# EAGLE design tweeq-Downloader_Basicv4 (EAGLE 7.2.0)
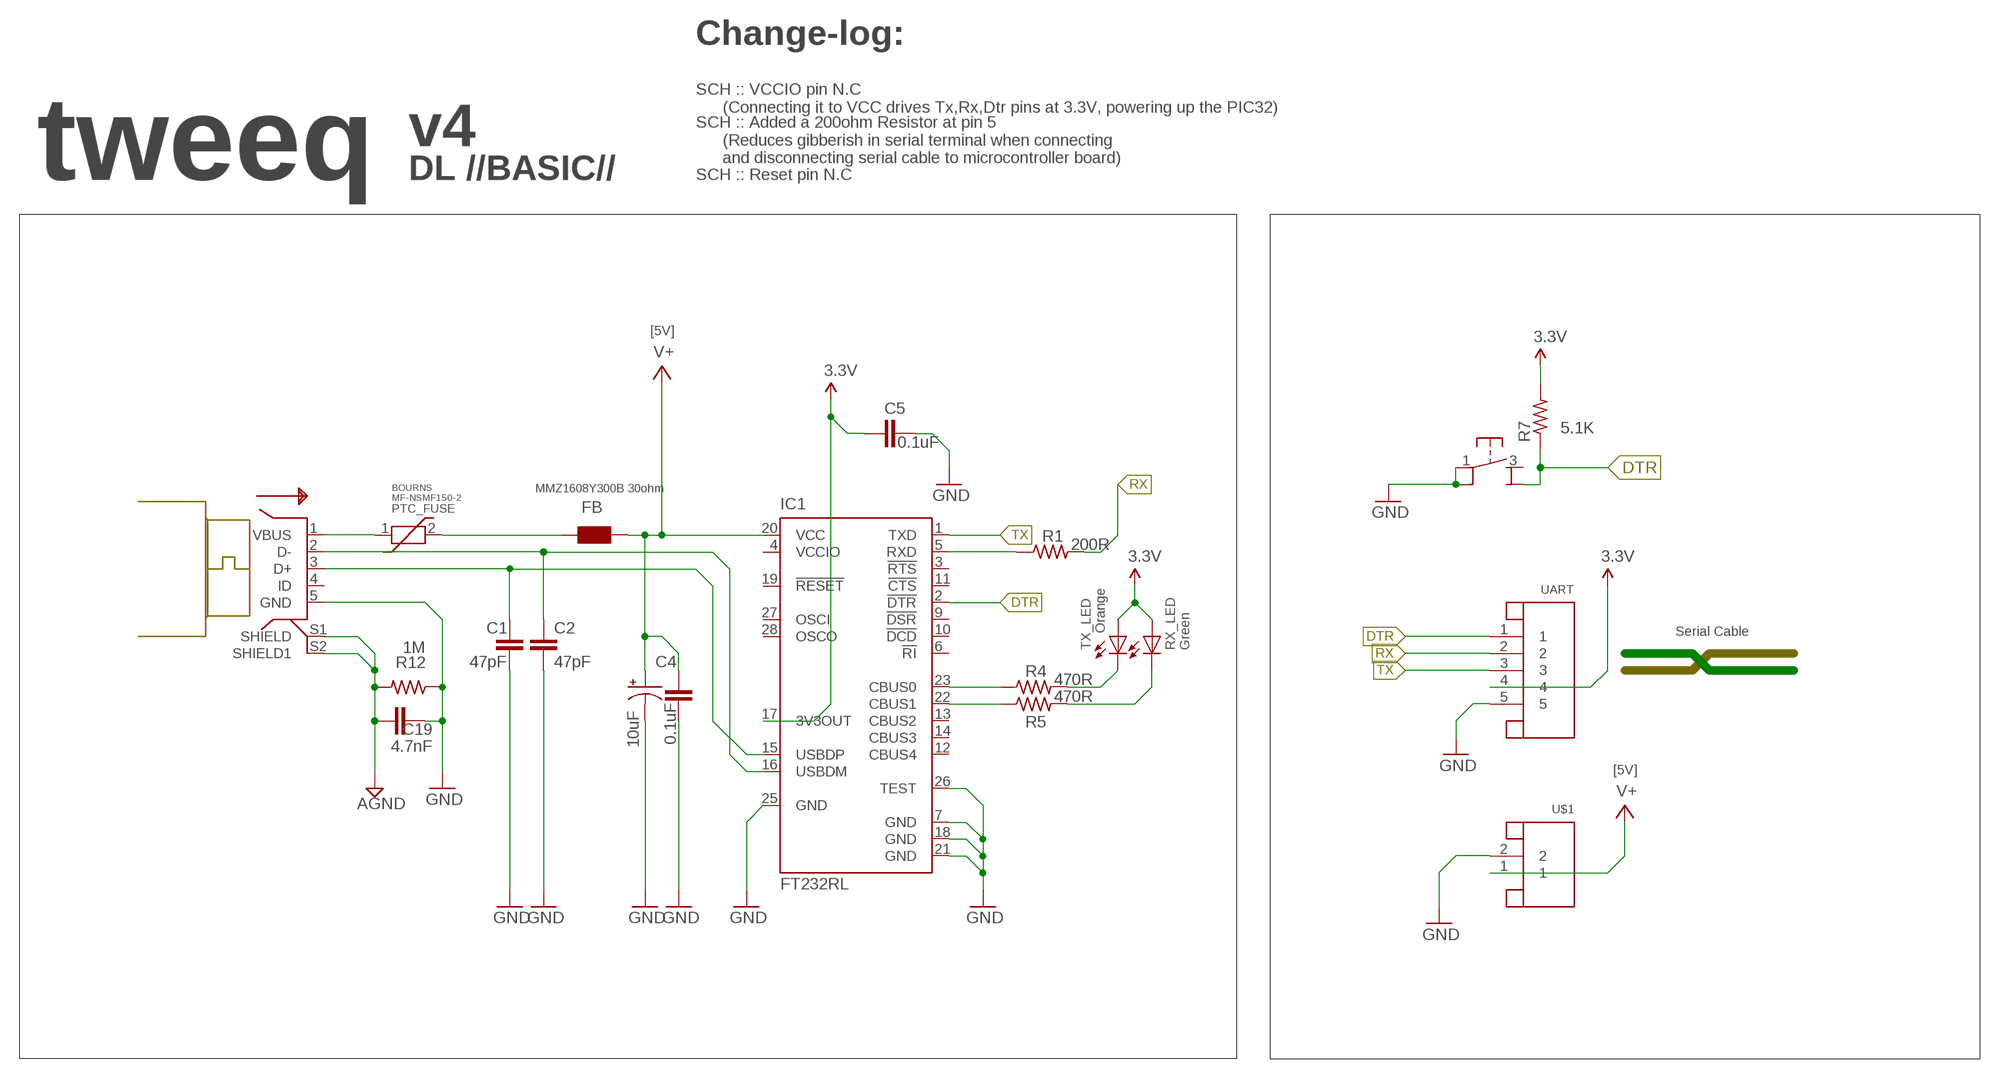
[diagram p0: schematic, sheet 1]

## Parts
C1  47pF  C-EUC0603K  [C0603K]
C2  47pF  C-EUC0603K  [C0603K]
C3  10uF  CPOL-USSMCA  [SMC_A]
C4  0.1uF  C-EUC0603K  [C0603K]
C5  0.1uF  C-EUC0603K  [C0603K]
C19  4.7nF  C-EUC0603K  [C0603K]
FB  MMZ1608Y300B 30ohm  WE-CBF_0603  [0603]
IC1  FT232RL  [SSOP28]
PTC_FUSE  PTC_FUSE/MF-NSMF150-2  [1206F]
R1  200R  R-US_R0603  [R0603]
R4  470R  R-US_R0603  [R0603]
R5  470R  R-US_R0603  [R0603]
R7  5.1K  R-US_R0603  [R0603]
R12  1M  R-US_R0603  [R0603]
RX_LED  Green  LEDCHIP-LED0805  [CHIP-LED0805]
TX_LED  Orange  LEDCHIP-LED0805  [CHIP-LED0805]
U$1  JST-2PINSH  [SH1.0-2PIN]
U$2  USB/MICRO-5PF-B  [MICRO_USB_5PF_B]
U$4  PB_MICRO_SMT  [PB_SMT_3.5X3X2]
UART  JST-5PINSH  [SH1.0-5PIN]

## Nets
3.3V: C5.1 IC1.17(3V3OUT) R7.2 RX_LED.A TX_LED.A UART.4
AGND: C19.2 R12.2 U$2.S1(SHIELD) U$2.S2(SHIELD1)
D+: C1.1 IC1.15(USBDP) U$2.3(D+)
D-: C2.1 IC1.16(USBDM) U$2.2(D-)
DTR: IC1.2(!DTR) R7.1 U$4.4(2A) UART.1
GND: C1.2 C2.2 C3.- C4.2 C5.2 C19.1 IC1.7(GND) IC1.18(GND) IC1.21(GND) IC1.25(GND) IC1.26(TEST) R12.1 U$1.2 U$2.5(GND) U$4.1 U$4.2(1A) UART.5
N$1: PTC_FUSE.1 U$2.1(VBUS)
N$2: FB.2 PTC_FUSE.2
N$3: IC1.5(RXD) R1.1
N$9: IC1.23(CBUS0) R4.1
N$10: IC1.22(CBUS1) R5.1
N$11: R4.2 TX_LED.C
N$12: R5.2 RX_LED.C
RX: R1.2 UART.2
TX: IC1.1(TXD) UART.3
V+: C3.+ C4.1 FB.1 IC1.20(VCC) U$1.1
Unconnected: IC1.3(!RTS) IC1.6(!RI) IC1.9(!DSR) IC1.10(!DCD) IC1.11(!CTS) IC1.12(CBUS4) IC1.13(CBUS2) IC1.14(CBUS3) IC1.19(!RESET) IC1.27(OSCI) IC1.28(OSCO) U$2.4(ID) U$4.3

## Notes on the sheet
- Change-log:
- SCH :: VCCIO pin N.C 
        (Connecting it to VCC drives Tx,Rx,Dtr pins at 3.3V, powering up the PIC32)
- v4
- SCH :: Added a 200ohm Resistor at pin 5 
        (Reduces gibberish in serial terminal when connecting
        and disconnecting serial cable to microcontroller board)
- tweeq | DL //BASIC// | SCH :: Reset pin N.C
- [5V]
- BOURNS
  MF-NSMF150-2
- Serial Cable
- [5V]

## Power pins joined to a net without a drawn wire
VCCIO: IC1.4(VCCIO)

## Library data of the parts
C1 C2 C4 C5 = AISCube:C-EU: CAPACITOR, European symbol
C3 = AISCube:CPOL-US: POLARIZED CAPACITOR, American symbol
C19 = rcl:C-EU: CAPACITOR, European symbol
FB = wuerth-elektronik:WE-CBF: SMD EMI Suppression Ferrite Beads - excellent anti-EMI properties - low DCR - impedances till 3000 ohms - rated current up to 6 A
IC1 = ftdichip:FT232R: Source: http://www.ftdichip.com/Documents/DataSheets/DS_FT232R_v104.pdf; MPN: FT232RL; OC_FARNELL: 1146032; OC_NEWARK: 91K9918
PTC_FUSE = AISCube:PTC_FUSE: MF-NSMF Series - PTC Resettable Fuses
R1 R4 R5 R7 R12 = AISCube:R-US_: RESISTOR, American symbol
RX_LED TX_LED = AISCube:LED: LED OSRAM: - CHIPLED LG R971, LG N971, LY N971, LG Q971, LY Q971, LO R971, LY R971 LH N974, LH R974 LS Q976, LO Q976, LY Q976 LO Q996 - Hyper CHIPLED LW Q18S LB Q993, LB Q99A, LB R99A - SideLED LS A670, LO A670, LY A670, LG A670, LP A670 LB A673, LV A673, LT A673, LW A673 LH A674 LY A675 LS A676, LA A676, LO A676, LY A676, LW A676 LS A679, LY A679, LG A679 - Hyper Micro SIDELED® LS Y876, LA Y876, LO Y876, LY Y876 LT Y87S - SmartLED LW L88C, LW L88S LB L89C, LB L89S, LG L890 LS L89K, LO L89K, LY L89K LS L896, LA L896, LO L896, LY L896 - TOPLED LS T670, LO T670, LY T670, LG T670, LP T670 LSG T670, LSP T670, LSY T670, LOP T670, LYG T670 LG T671, LOG T671, LSG T671 LB T673, LV T673, LT T673, LW T673 LH T674 LS T676, LA T676, LO T676, LY T676, LB T676, LH T676, LSB T676, LW T676 LB T67C, LV T67C, LT T67C, LS T67K, LO T67K, LY T67K, LW E67C LS E67B, LA E67B, LO E67B, LY E67B, LB E67C, LV E67C, LT E67C LW T67C LS T679, LY T679, LG T679 LS T770, LO T770, LY T770, LG T770, LP T770 LB T773, LV T773, LT T773, LW T773 LH T774 LS E675, LA E675, LY E675, LS T675 LS T776, LA T776, LO T776, LY T776, LB T776 LHGB T686 LT T68C, LB T68C - Hyper Mini TOPLED® LB M676 - Mini TOPLED Santana® LG M470 LS M47K, LO M47K, LY M47K Source: http://www.osram.convergy.de/
U$1 = AISCube:JST-2PIN
U$2 = AISCube:USB: USB 1.x/2.0 Mini/Micro Pinout Pin Name Cable color Description 1 VBUS Red +5 V 2 D− White Data − 3 D+ Green Data + 4 ID N/A Permits distinction of a host connection from device connection: • host: connected to the signal ground • device: not connected 5 GND Black Signal ground
U$4 = AISCube:PB_MICRO_SMT
UART = AISCube:JST-5PIN: JST 5 Pin

## Board
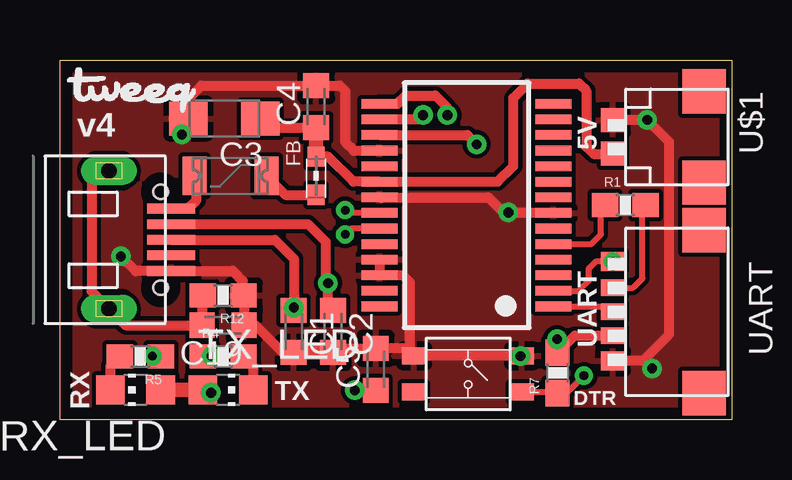
[diagram p1: board, top side]
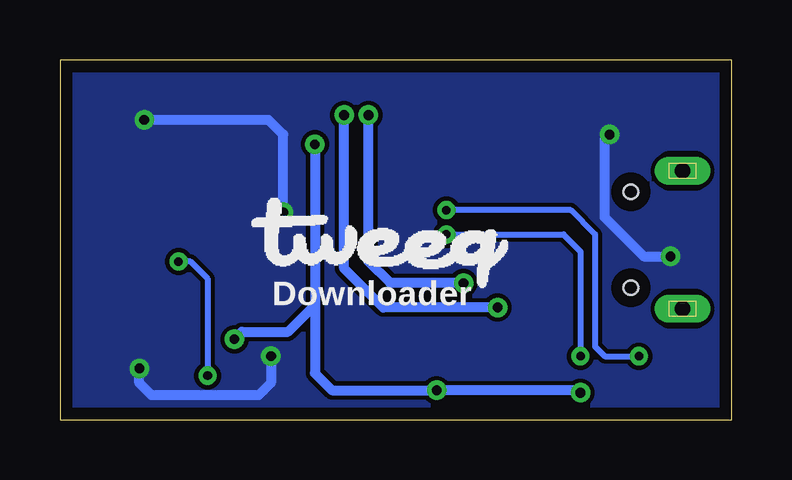
[diagram p2: board, bottom side, seen from below]

Size 28 x 15 mm. Coordinates in mm from the lower left corner, seen from the top.
Outline: 0,0 0,15 28,15 28,0 0,0
Copper layers (1*16): Top 0.0356mm / dielectric 1.5011mm / Bottom 0.0356mm
Design rules "AISCube": minimum track width 7mil, minimum drill 14mil, track to track 7mil, track to pad 7mil, pad to pad 7mil, via to via 7mil, smd to smd 0mil, copper to edge 20mil, drill to drill 8mil, minimum pad ring 10mil, minimum via ring 8mil, stop-mask expansion 4mil, vias tented up to drill 32mil, thermal gap 10mil

### Footprints (pad centres in the part's own frame; a part is rotated, then mirrored left to right if it is on the bottom)
C0603K = smd 1.05 x 1.08: 1 -0.875,0; 2 0.875,0
SMC_A = smd 1.6 x 1.4: + -1.5,0; - 1.5,0
0603 = smd 0.85 x 0.7: 1 -0.9,0; 2 0.7,0
SSOP28 = smd 0.4 x 1.5: 1 -4.225,-3.625; 2 -3.575,-3.625; 3 -2.925,-3.625; 4 -2.275,-3.625; 5 -1.625,-3.625; 6 -0.975,-3.625; 7 -0.325,-3.625; 8 0.325,-3.625; 9 0.975,-3.625; 10 1.625,-3.625; 11 2.275,-3.625; 12 2.925,-3.625; 13 3.575,-3.625; 14 4.225,-3.625; 15 4.225,3.625; 16 3.575,3.625; 17 2.925,3.625; 18 2.275,3.625; 19 1.625,3.625; 20 0.975,3.625; 21 0.325,3.625; 22 -0.325,3.625; 23 -0.975,3.625; 24 -1.625,3.625; 25 -2.275,3.625; 26 -2.925,3.625; 27 -3.575,3.625; 28 -4.225,3.625
1206F = smd 1 x 1.6: 1 -1.5,0; 2 1.5,0
R0603 = smd 1.1 x 1: 1 -0.85,0; 2 0.85,0
CHIP-LED0805 = smd 1.2 x 1.2: A 0,-1.05; C 0,1.05
SH1.0-2PIN = smd 1 x 1: 1 0.7,-0.55; 2 -0.7,-0.55 | smd 1.85 x 1.8: P$1 -1.9,3.25; P$2 1.9,3.25
MICRO_USB_5PF_B = smd 2 x 0.406: 1 -0.05,1.3; 2 -0.05,0.65; 3 -0.05,0; 4 -0.05,-0.65; 5 -0.05,-1.3 | drill 0.65 pad 1.05 long: S1 -2.65,2.875; S2 -2.65,-2.875 | hole 0.6: -0.5,2; -0.5,-2
PB_SMT_3.5X3X2 = smd 1 x 0.7: 1 -2.25,0.75; 2 2.25,0.75; 3 -2.25,-0.75; 4 2.25,-0.75
SH1.0-5PIN = smd 0.8 x 1: 1 -2.09,-0.55; 5 2.05,-0.55 | smd 0.7 x 1: 2 -1,-0.55; 3 0,-0.55; 4 1,-0.55 | smd 1.85 x 1.8: P$1 -3.4,3.25; P$2 3.4,3.25

### Placement (x,y rotation side)
C1  9.75,3.68 270 top
C2  11.39,3.68 270 top
C3  6.85,12.55 180 top
C4  10.68,13.06 90 top
C5  13.17,2.09 90 top
C19  6.81,3.94 180 top
FB  10.68,10.07 270 top
IC1  16.96,8.94 90 top
PTC_FUSE  7.11,10.16 0 top
R1  23.57,8.94 0 top
R4  6.81,2.63 0 top
R5  3.35,2.63 180 top
R7  20.75,1.95 90 top
R12  6.81,5.18 180 top
RX_LED  3.15,1.24 90 top
TX_LED  7.01,1.24 270 top
U$1  23.6,11.79 270 top
U$2  4.7,7.5 0 top
U$3  [TWEEQ-LOGO-S]  0.3,12.8 0 top
U$4  17.02,1.91 0 top
U$5  [TWEEQ-LOGO-L]  20.02,5.49 0 bottom
UART  23.6,4.5 270 top

### Tracks (layer width: path | path; a pad name or v marks a point on that pad's centre or on a via)
3.3V  (via drill 0.41)
  Top 0.406: v12.29,1.22 v12.3,1.22 C5.1 | IC1.17 16.99,11.87 v17.37,11.48 | UART.4 21.45,3.5 R7.2 20.75,3.33 v20.73,3.35 | TX_LED.A 6.18,1.24 v6.3,1.12
  Top 0.61: RX_LED.A TX_LED.A
  Bottom 0.406: v17.37,11.48 17.37,4.78 | 17.37,4.78 17.37,1.93 16.66,1.22 v12.29,1.22 6.4,1.22 v6.3,1.12 | v20.73,3.35 20.42,3.66 18.49,3.66 17.37,4.78
AGND
  Top 0.406: 5.85,3.99 C19.2 | U$2.S1 1.74,10.38 1.32,9.96 1.32,5.35 U$2.S2 2.73,3.94 C19.2 | R12.2 5.93,5.16 C19.2
D+  (via drill 0.41)
  Top 0.406: U$2.3 8.96,7.5 9.75,6.71 v9.75,4.67 C1.1 | IC1.15 14.08,13.17 14.43,13.51 15.65,13.51 16.15,13.01 v16.15,12.7
  Bottom 0.406: v9.75,4.67 14.53,4.67 16.15,6.3 v16.15,12.7
D-  (via drill 0.41)
  Top 0.406: 11.38,4.56 C2.1 11.18,4.77 v11.18,5.69 11.07,5.79 11.07,7.42 10.34,8.15 U$2.2 | IC1.16 14.91,12.52 15.1,12.7 v15.14,12.7
  Bottom 0.406: v11.18,5.69 14.22,5.69 15.14,6.6 v15.14,12.7
DTR  (via drill 0.36)
  Top 0.254: IC1.2 21.62,5.37 22.05,5.79 22.05,6.3 22.34,6.59 UART.1 | U$4.4 20.69,1.16 R7.1 21.11,1.1 v21.84,1.83
  Bottom 0.254: UART.1 22.55,6.59 21.84,5.88 v21.84,1.83
  other vias: 23.05,6.59
GND  (via drill 0.41)
  Top 0.406: 10.79,14.02 C4.2 | C4.2 11.67,13.93 11.89,13.72 11.89,11.58 12.25,11.22 IC1.18 | C2.2 11.39,2.74 11.62,2.97 C5.2 14.46,2.97 U$4.1 | U$4.1 U$4.2 19.25,2.64 v19.2,2.64 | U$4.1 14.59,2.66 14.59,5.73 14.3,6.02 IC1.26 IC1.25 | 22.96,12.39 U$1.2 23.06,12.5 v24.49,12.5 25.4,11.58 25.4,3.56 24.29,2.45 UART.5 | 23.14,2.54 UART.5 | UART.5 23.07,2.44 23.37,2.44 | v24.69,2.13 24.37,2.45 UART.5 | IC1.21 17.86,9.27 18.49,8.64 v18.69,8.64 18.71,8.62 IC1.7 | v2.54,6.81 3.15,6.2 5.04,6.2 U$2.5 7.21,6.2 7.62,5.79 7.62,5.22 R12.1 7.68,5.16 C19.1 8.15,3.94 9.29,2.81 C1.2 | C4.2 5.9,13.93 5.28,13.31 5.28,12.62 C3.- 5.08,12.28 v5.08,11.89
  Top 0.61: C2.2 C1.2
  Bottom 0.406: v19.2,2.64 19.2,1.52 19.71,1.02 24.18,1.02 24.69,1.52 v24.69,2.13 | v5.08,11.89 5.28,11.68 5.28,8.43 3.66,6.81 v2.54,6.81 | v18.69,8.64 18.69,11.89 19.3,12.5 v24.49,12.5
  pour Bottom: 0.2,14.83 27.87,14.83 27.87,0.2 0.2,0.2
  pour Top: 0.2,14.83 27.87,14.83 27.87,0.2 0.2,0.2
N$1
  Top 0.406: U$2.1 5.35,8.8 5.69,9.14 5.69,10.08 PTC_FUSE.1
N$2
  Top 0.406: PTC_FUSE.2 9.4,9.37 FB.2
N$3
  Top 0.254: IC1.5 22.15,7.32 22.55,7.72 22.55,8.78 R1.1
N$9  (via drill 0.36)
  Top 0.254: IC1.23 12.13,7.97 v11.89,7.72 | v6.3,2.64 5.97,2.64 R4.1
  Bottom 0.254: v11.89,7.72 7.01,7.72 6.3,7.01 v6.3,2.64
N$10  (via drill 0.36)
  Top 0.254: v3.86,2.64 4.2,2.64 R5.1 | IC1.22 12.01,8.62 v11.89,8.74
  Bottom 0.254: v3.86,2.64 5.28,2.64 5.69,3.05 5.69,7.72 6.71,8.74 v11.89,8.74
N$11
  Top 0.406: R4.2 8.06,2.23 TX_LED.C
N$12
  Top 0.406: R5.2 2.1,2.23 RX_LED.C
RX
  Top 0.254: 24.08,8.68 R1.2 24.28,8.8 24.28,5.89 23.89,5.5 UART.2
TX
  Top 0.254: IC1.1 22.84,4.72 UART.3
V+
  Top 0.406: FB.1 11.18,10.97 12.23,9.92 IC1.20 18.25,9.92 18.9,10.57 18.9,13.41 19.51,14.02 21.64,14.02 21.95,13.72 21.95,11.38 22.25,11.07 23.04,11.07 U$1.1 | C3.+ 8.73,12.18 C4.1
  Top 0.61: C4.1 FB.1

### Text on the board
tPlace: v4 | 5V | UART | RX | TX | DTR
bPlace: Downloader